# Altium schematic sheet buck.SchDoc
size A3
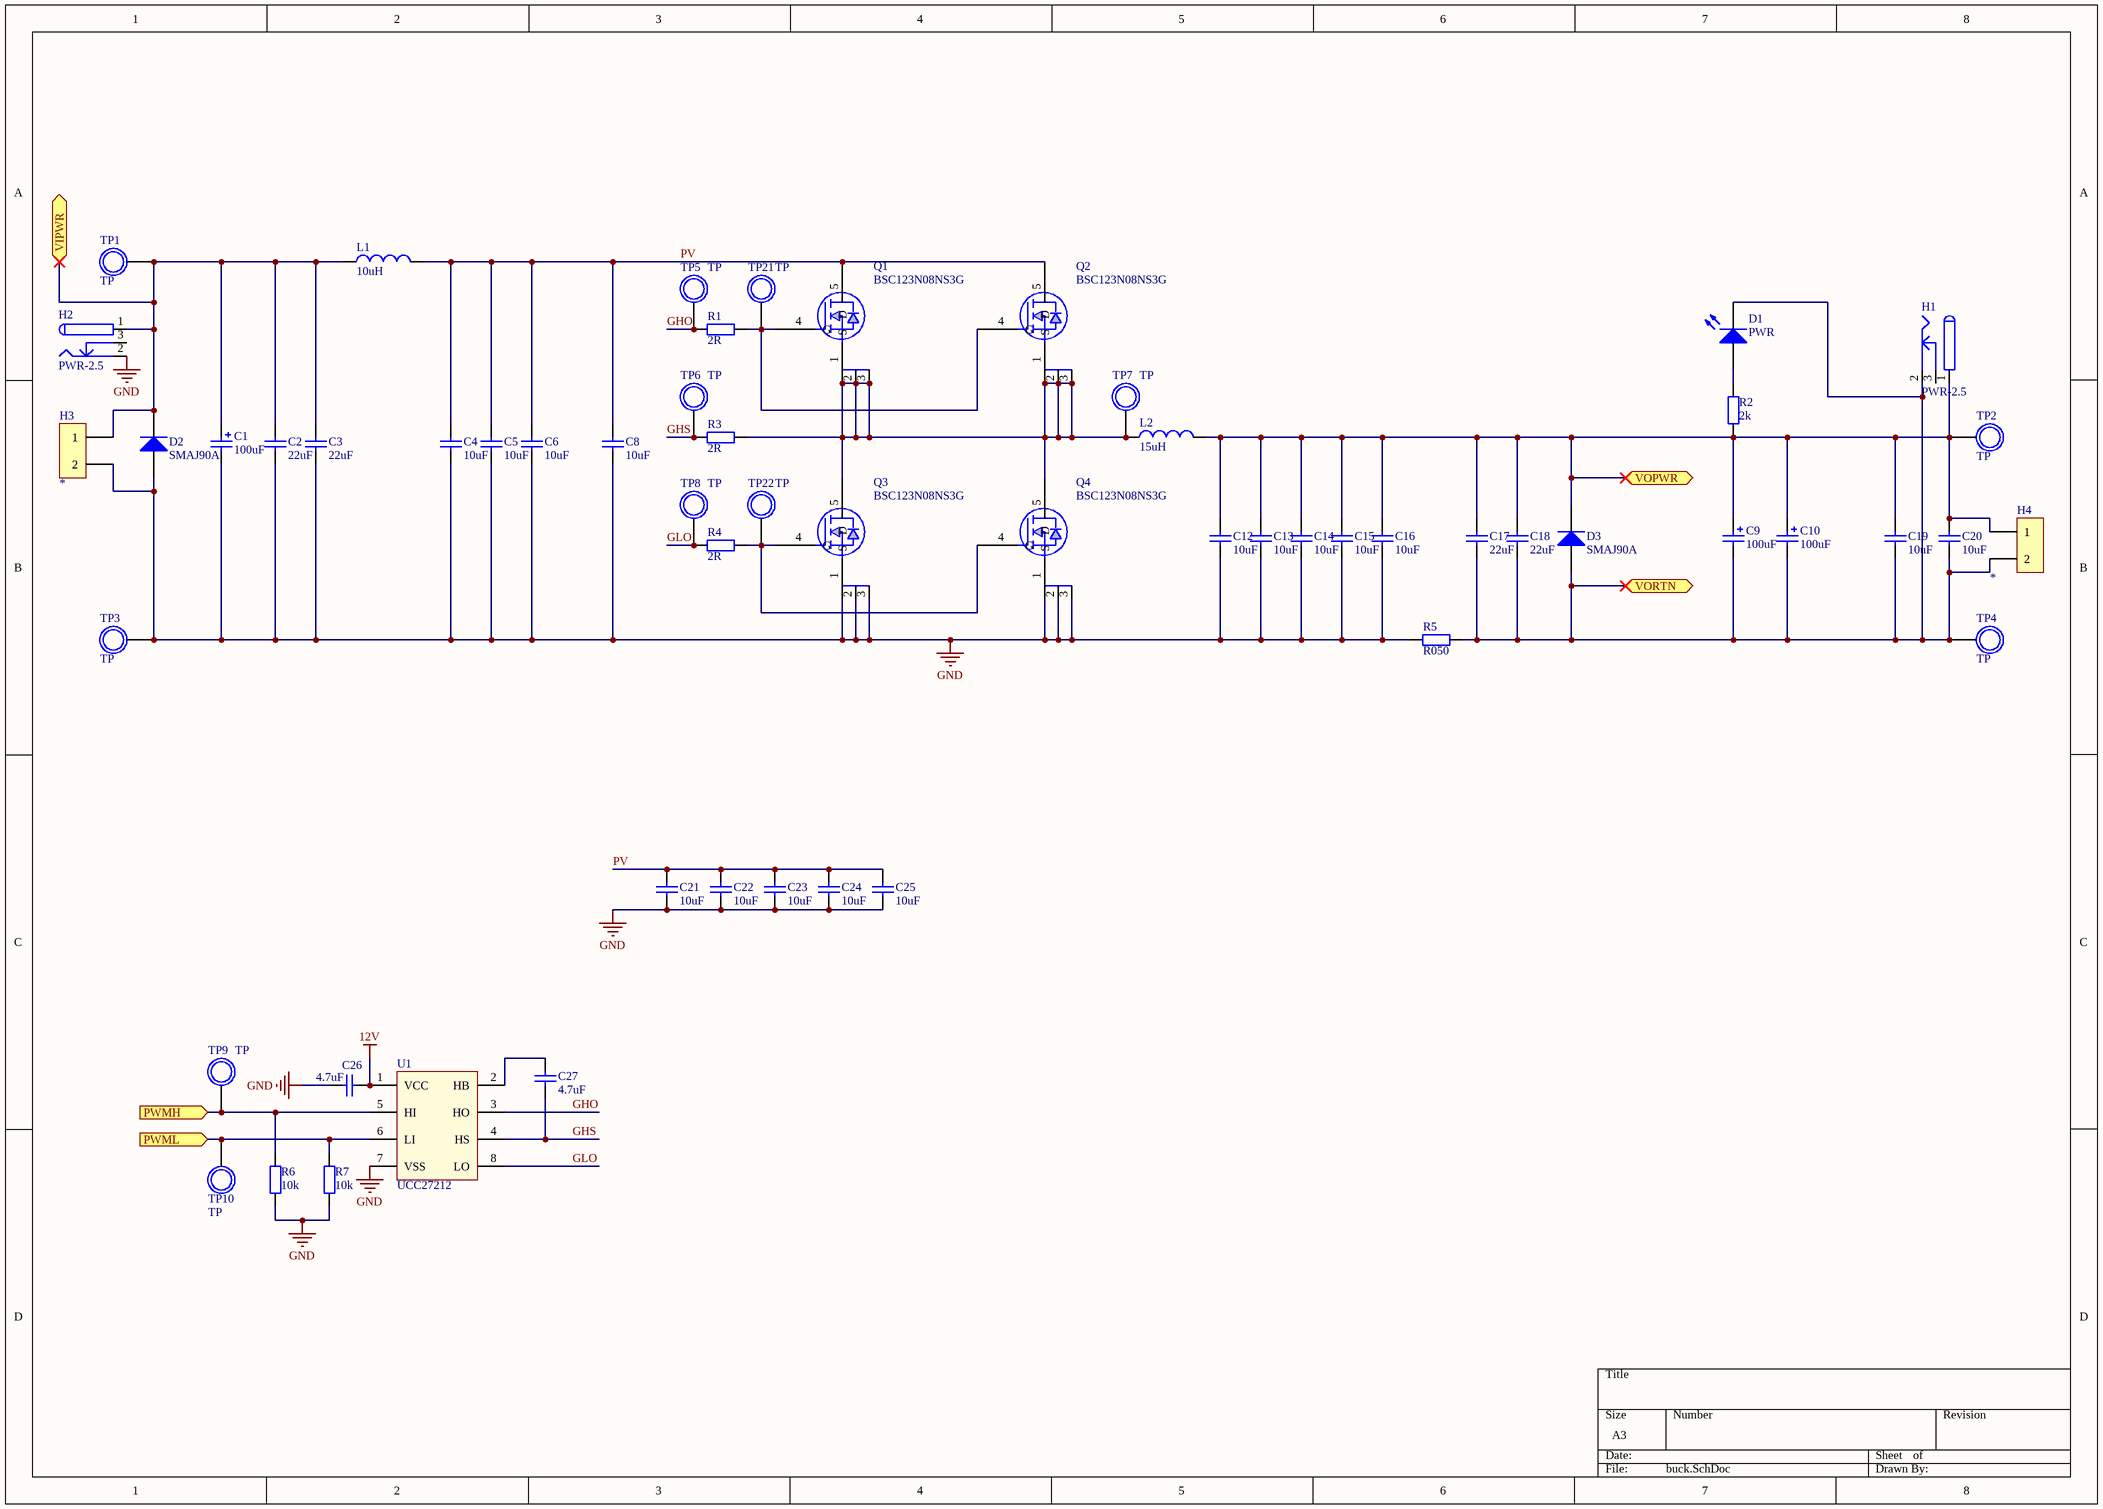
[diagram p0: buck.SchDoc]

## Parts
C1  100uF  [CAPAE109103X105N]
C2  22uF  [CAP1206]
C3  22uF  [CAP1206]
C4  10uF  [CAP1206]
C5  10uF  [CAP1206]
C6  10uF  [CAP1206]
C8  10uF  [CAP1206]
C9  100uF  [CAPAE109103X105N]
C10  100uF  [CAPAE109103X105N]
C12  10uF  [CAP1206]
C13  10uF  [CAP1206]
C14  10uF  [CAP1206]
C15  10uF  [CAP1206]
C16  10uF  [CAP1206]
C17  22uF  [CAP1206]
C18  22uF  [CAP1206]
C19  10uF  [CAP1206]
C20  10uF  [CAP1206]
C21  10uF  [CAP1206]
C22  10uF  [CAP1206]
C23  10uF  [CAP1206]
C24  10uF  [CAP1206]
C25  10uF  [CAP1206]
C26  4.7uF  [CAP1206]
C27  4.7uF  [CAP1206]
D1  PWR  [LED0603]
D2  SMAJ90A  [SMA]
D3  SMAJ90A  [SMA]
H1  PWR-2.5  [PWR-2.5]
H2  PWR-2.5  [PWR-2.5]
H3  *  [KF301]
H4  *  [KF301]
L1  10uH  [CDRH125]
L2  15uH  [CDRH125]
Q1  BSC123N08NS3G  [QFN5x6]
Q2  BSC123N08NS3G  [QFN5x6]
Q3  BSC123N08NS3G  [QFN5x6]
Q4  BSC123N08NS3G  [QFN5x6]
R1  2R  [RES1206]
R2  2k  [RES0603]
R3  2R  [RES1206]
R4  2R  [RES1206]
R5  R050  [RESC6432X07N]
R6  10k  [RES0603]
R7  10k  [RES0603]
TP1  TP  [PAD85R]
TP2  TP  [PAD85R]
TP3  TP  [PAD85R]
TP4  TP  [PAD85R]
TP5  TP  [PAD85R]
TP6  TP  [PAD85R]
TP7  TP  [PAD85R]
TP8  TP  [PAD85R]
TP9  TP  [PAD85R]
TP10  TP  [PAD85R]
TP21  TP  [PAD85R]
TP22  TP  [PAD85R]
U1  UCC27212  [SOP127P600X175-8N]

## Ports
PWMH (in), PWML (in), VIPWR (bidir), VOPWR (bidir), VORTN (bidir)

## Nets
12V: C26.2 U1.1(VCC)
GND: C1.1 C2.1 C3.1 C4.1 C5.1 C6.1 C8.1 C12.1 C13.1 C14.1 C15.1 C16.1 C21.1 C22.1 C23.1 C24.1 C25.1 C26.1 D2.1(A) H2.2 H3.2 Q3.1(S) Q3.2 Q3.3 Q4.1(S) Q4.2 Q4.3 R5.1 R6.1 R7.1 TP3.1 U1.7(VSS)
GHO: R1.1 TP5.1 U1.3(HO)
GHS: C27.1 R3.1 TP6.1 U1.4(HS)
GLO: R4.1 TP8.1 U1.8(LO)
PV: C4.2 C5.2 C6.2 C8.2 C21.2 C22.2 C23.2 C24.2 C25.2 L1.2 Q1.5(D) Q2.5(D)
PWMH: R6.2 TP9.1 U1.5(HI) ; port PWMH
PWML: R7.2 TP10.1 U1.6(LI) ; port PWML
VIPWR: C1.2 C2.2 C3.2 D2.2(K) H2.1 H3.1 L1.1 TP1.1 ; port VIPWR
VOPWR: C9.2 C10.2 C12.2 C13.2 C14.2 C15.2 C16.2 C17.2 C18.2 C19.2 C20.2 D3.2(K) H1.1 H4.1 L2.2 R2.1 TP2.1 ; port VOPWR
VORTN: C9.1 C10.1 C17.1 C18.1 C19.1 C20.1 D1.2(K) D3.1(A) H1.2 H4.2 R5.2 TP4.1 ; port VORTN
NetC27_2: C27.2 U1.2(HB)
NetD1_1: D1.1(A) R2.2
NetL2_1: L2.1 Q1.1(S) Q1.2 Q1.3 Q2.1(S) Q2.2 Q2.3 Q3.5(D) Q4.5(D) R3.2 TP7.1
NetQ1_4: Q1.4(G) Q2.4(G) R1.2 TP21.1
NetQ3_4: Q3.4(G) Q4.4(G) R4.2 TP22.1

Not connected (* = marked no-connect by the designer): H1 3; H2 3

## Library data of the parts
C1 C9 C10 = CAP_Pol: cap pol; Tolerance: +\- 10%; Capacitance Value: 47uF; Rated Voltage: 50V
C2-C6 C8 C12-C27 = CAP: CAP NON-POL; Tolerance: +/-10%; Rated Voltage: 50V; Capacitance Value: 0.1uF
D1 = LED
D2 D3 = Diode
H3 H4 = Connector-2P
L1 L2 = Inductor
Q1-Q4 = MOS-N4: N Channel MOSFET
R1-R7 = RES
TP1-TP10 TP21 TP22 = Test_Point: test point
U1 = UCC27211: UCC2721x 120-V Boot, 4-A Peak, High-Frequency High-Side and Low-Side Driver